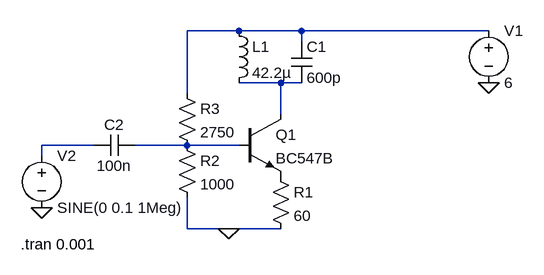
[diagram p0: schematic ClassC_amp.asc]
ClassC_amp.asc, the LTspice schematic file:
Version 4
SHEET 1 880 680
WIRE 176 16 96 16
WIRE 272 16 176 16
WIRE 560 16 272 16
WIRE 272 32 272 16
WIRE 240 96 176 96
WIRE 272 96 240 96
WIRE 96 112 96 16
WIRE 240 144 240 96
WIRE -48 192 -128 192
WIRE 96 192 16 192
WIRE 176 192 96 192
WIRE -128 208 -128 192
WIRE 96 320 96 272
WIRE 160 320 96 320
WIRE 240 320 160 320
FLAG 560 96 0
FLAG -128 288 0
FLAG 160 320 0
SYMBOL npn 176 144 R0
SYMATTR InstName Q1
SYMATTR Value BC547B
SYMBOL ind 160 0 R0
SYMATTR InstName L1
SYMATTR Value 42.2µ
SYMBOL cap 256 32 R0
SYMATTR InstName C1
SYMATTR Value 600p
SYMBOL res 224 224 R0
SYMATTR InstName R1
SYMATTR Value 60
SYMBOL res 80 176 R0
SYMATTR InstName R2
SYMATTR Value 1000
SYMBOL res 80 96 R0
SYMATTR InstName R3
SYMATTR Value 2750
SYMBOL voltage 560 0 R0
WINDOW 123 0 0 Left 0
WINDOW 39 0 0 Left 0
SYMATTR InstName V1
SYMATTR Value 6
SYMBOL voltage -128 192 R0
WINDOW 123 0 0 Left 0
WINDOW 39 0 0 Left 0
SYMATTR InstName V2
SYMATTR Value SINE(0 0.1 1Meg)
SYMBOL cap 16 176 R90
WINDOW 0 0 32 VBottom 2
WINDOW 3 32 32 VTop 2
SYMATTR InstName C2
SYMATTR Value 100n
TEXT -160 344 Left 2 !.tran 0.001

The netlist it stands for:
* ClassC_amp.asc
Q1 N002 N004 P001 0 BC547B
L1 N001 N002 42.2µ
C1 N001 N002 600p
R1 P001 0 60
R2 N004 0 1000
R3 N001 N004 2750
V1 N001 0 6
V2 N003 0 SINE(0 0.1 1Meg)
C2 N004 N003 100n
.model NPN NPN
.model PNP PNP
.lib standard.bjt
.tran 0.001
.backanno
.end